# EAGLE schematic JTAG (EAGLE 6.6.0)
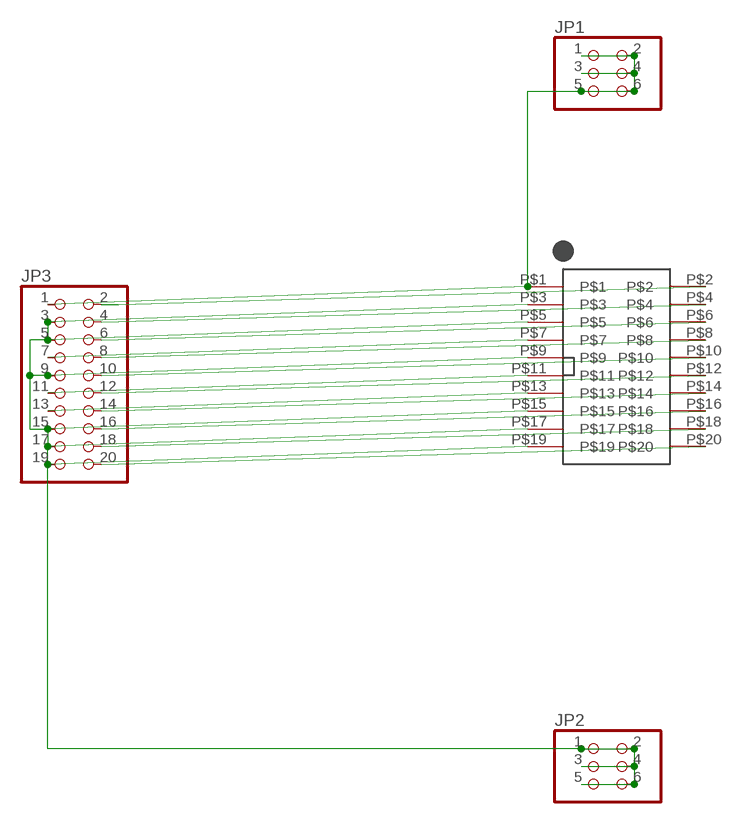
[diagram p0: schematic, sheet 1]

## Parts
JP1  PINHD-2X3  [2X03]
JP2  PINHD-2X3  [2X03]
JP3  PINHD-2X10  [2X10]
U$3  2X10JTAG  [2X10JTAG]

## Nets
N$1: JP1.1 JP1.2 JP1.3 JP1.4 JP1.5 JP1.6 JP3.1 U$3.P$1
N$2: JP3.2 U$3.P$2
N$3: JP3.4 U$3.P$4
N$4: JP3.6 U$3.P$6
N$5: JP3.8 U$3.P$8
N$6: JP3.10 U$3.P$10
N$7: JP3.12 U$3.P$12
N$8: JP3.14 U$3.P$14
N$9: JP3.16 U$3.P$16
N$10: JP3.18 U$3.P$18
N$11: JP3.20 U$3.P$20
N$12: JP2.1 JP2.2 JP2.3 JP2.4 JP2.5 JP2.6 JP3.3 JP3.5 JP3.9 JP3.15 JP3.17 JP3.19 U$3.P$3 U$3.P$5 U$3.P$9 U$3.P$15 U$3.P$17 U$3.P$19
N$14: JP3.7 U$3.P$7
N$16: JP3.11 U$3.P$11
N$27: JP3.13 U$3.P$13

## Library data of the parts
JP1 JP2 = pinhead:PINHD-2X3: PIN HEADER
JP3 = pinhead:PINHD-2X10: PIN HEADER
U$3 = KW2:2X10JTAG; MFGN: CNC Tech; MFGP: 3220-20-0100-00